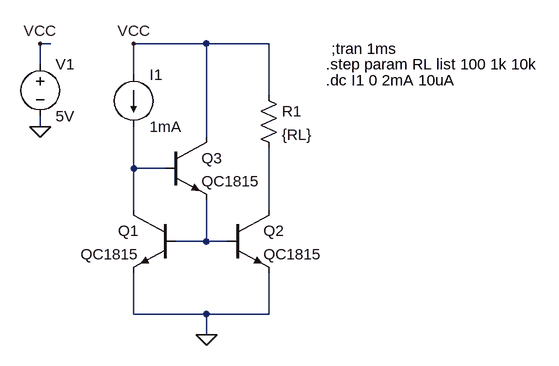
[diagram p0: schematic CurrentMirror2.asc]
CurrentMirror2.asc, the LTspice schematic file:
Version 4
SHEET 1 880 680
WIRE -400 -208 -416 -208
WIRE -160 -208 -272 -208
WIRE -64 -208 -160 -208
WIRE -416 -176 -416 -208
WIRE -272 -160 -272 -208
WIRE -64 -128 -64 -208
WIRE -416 -80 -416 -96
WIRE -160 -64 -160 -208
WIRE -272 -16 -272 -80
WIRE -224 -16 -272 -16
WIRE -272 48 -272 -16
WIRE -64 48 -64 -48
WIRE -160 96 -160 32
WIRE -160 96 -208 96
WIRE -128 96 -160 96
WIRE -272 208 -272 144
WIRE -160 208 -272 208
WIRE -64 208 -64 144
WIRE -64 208 -160 208
WIRE -160 240 -160 208
FLAG -160 240 0
FLAG -272 -208 VCC
FLAG -416 -80 0
FLAG -416 -208 VCC
SYMBOL npn -208 48 M0
SYMATTR InstName Q1
SYMATTR Value QC1815
SYMBOL npn -128 48 R0
SYMATTR InstName Q2
SYMATTR Value QC1815
SYMBOL current -272 -160 R0
WINDOW 123 0 0 Left 2
WINDOW 39 0 0 Left 2
SYMATTR InstName I1
SYMATTR Value 1mA
SYMBOL res -80 -144 R0
SYMATTR InstName R1
SYMATTR Value {RL}
SYMBOL voltage -416 -192 R0
WINDOW 123 0 0 Left 2
WINDOW 39 0 0 Left 2
SYMATTR InstName V1
SYMATTR Value 5V
SYMBOL npn -224 -64 R0
SYMATTR InstName Q3
SYMATTR Value QC1815
TEXT 32 -200 Left 2 !;tran 1ms
TEXT 24 -176 Left 2 !.step param RL list 100 1k 10k
TEXT 24 -152 Left 2 !.dc I1 0 2mA 10uA

The netlist it stands for:
* CurrentMirror2.asc
Q1 N001 N003 0 0 QC1815
Q2 N002 N003 0 0 QC1815
I1 VCC N001 1mA
R1 VCC N002 {RL}
V1 VCC 0 5V
Q3 VCC N001 N003 0 QC1815
.model NPN NPN
.model PNP PNP
.lib standard.bjt
;tran 1ms
.step param RL list 100 1k 10k
.dc I1 0 2mA 10uA
.backanno
.end